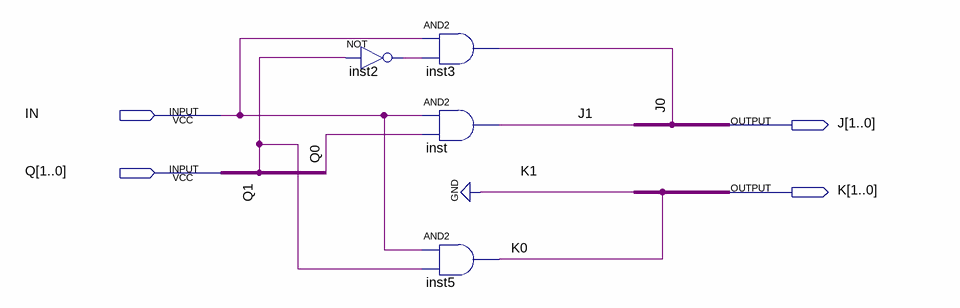
[diagram p0: schematic sheet]
// Quartus schematic CONVERT.bdf as structural Verilog: 4 symbols, 4 pins
module CONVERT (
  input  IN,
  input  [1:0] Q,
  output [1:0] J,
  output [1:0] K
);

  wire inst2_out;

  not inst2 (inst2_out, Q[1]);
  and inst3 (J[0], IN, inst2_out);
  and inst (J[1], IN, Q[0]);
  and inst5 (K[0], IN, Q[1]);

  assign K[1] = 1'b0;
endmodule
